# Altium schematic sheet 04. BUZZER.SchDoc
size A4; CheckedBy: 黄钦宁; Author: 陈坤; DocumentNumber: 4; SheetNumber: 4; SheetTotal: 13; PageSetup: Record=PageOptions|CenterHorizontal=True|CenterVertical=True|PrintScale=1.00|XCorrection=1.00|YCorrection=1.00|PrintKind=0|BorderSize=5000000|LeftOffset=0|BottomOffset=0|Orientation=2|PaperLength=1000|PaperWidth=1000|Scale=100|PaperSource=7|PrintQuality=600|MediaType=1|DitherType=10|PaperKind=A4|PrintScaleMode=1; DesignDate: 2013-08-16; CheckDate: 2013-12-28; SheetName: 3.3V NPN控制有源蜂鸣器; SheetVersion: V1.00; SheetDescription: 有源蜂鸣器,3.3V,高电平驱动,>2.0V鸣叫最大声,<1.2V彻底停止; ProductName: EasyARM-iMX28学习套件; ProductModel: EasyARM-iMX283
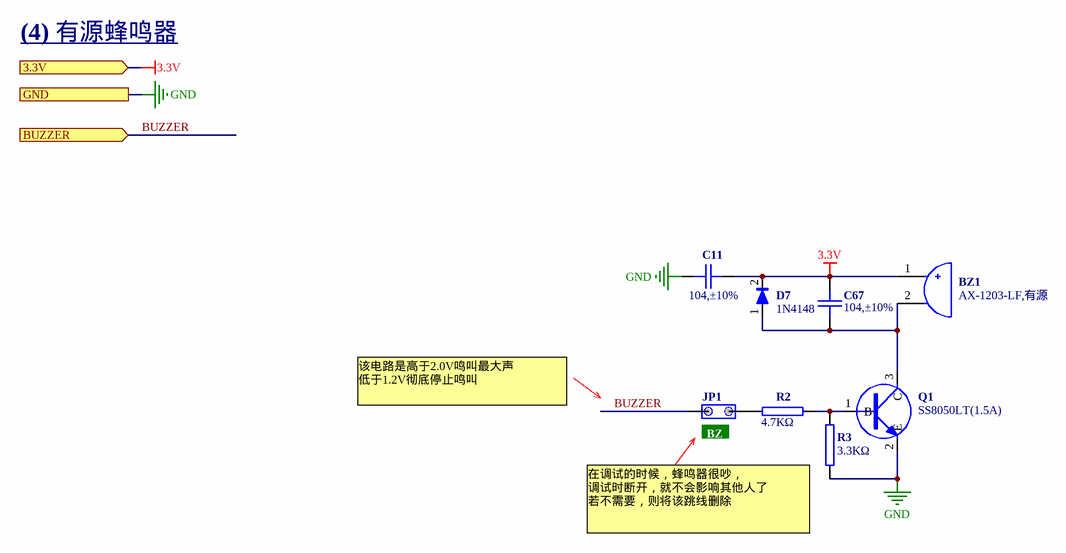
[diagram p0: 04. BUZZER.SchDoc]

## Parts
BZ1  value AX-1203-LF,有源  [BUZZ-.28/.46]  (hidden comment: BUZZER2)
C11  104,±10%  [0603C]
C67  104,±10%  [0603C]  (no BOM)
D7  value 1N4148  [SOD-323]  (hidden comment: DIODE1)  (no BOM)
JP1  120Ω_EN  [sip-2]  (value not drawn)
Q1  value SS8050LT(1.5A)  [SOT-23]  (hidden comment: NPN-1)
R2  4.7KΩ  [0603R]
R3  3.3KΩ  [0603R]

## Ports
3.3V, BUZZER (in), GND

## Nets
3.3V: BZ1.1(A) C11.1 C67.2 D7.2 ; port 3.3V
GND: C11.2 Q1.2(E) R3.1 ; port GND
BUZZER: JP1.1 ; port BUZZER
NetBZ1_2: BZ1.2(B) C67.1 D7.1 Q1.3(C)
NetJP1_2: JP1.2 R2.1
NetQ1_1: Q1.1(B) R2.2 R3.2

## Notes on the sheet
- (4) 有源蜂鸣器
- 该电路是高于2.0V鸣叫最大声
  低于1.2V彻底停止鸣叫
- (near JP1) BZ
- (near R3) 在调试的时候，蜂鸣器很吵，
  调试时断开，就不会影响其他人了
  若不需要，则将该跳线删除
- 1
- #
- 修改日期
- 修改内容
- 2
- 3
- 广州致远电子股份有限公司
- 设计人员
- 审核人员
- 设计日期
- 审核日期
- 产品名称
- 图纸名称
- 产品型号
- 图纸描述
- 图纸版本
- A4

## Library data of the parts
BZ1 = 1.06.09.0013: AX-1203-LF,有源,Φ12×7.5mm,,常州笠翔,RoHS; 名称: 讯响器; 贴片和直插: THT; 器件优选方案: 优先选用; 物料代码: 1.06.09.0013; 厂商: 常州笠翔; RoHS: RoHS; 型号: AX-1203-LF,有源,Φ12×7.5mm; ComponentLink1Description: ErpDataInfo; ComponentLink1URL: http://erp.zlgmcu.com/ErpExt/ErpData/ListMateriel.aspx?pkey=1.06.09.0013
C11 C67 = 1.02.01.0032: 104,±10%,50V,X7R,0603,*,RoHS; 名称: 电容; 封装: 0603; 设备封装名称: C0603_104_X7R_50V_10%; 贴片和直插: SMT; 物料代码: 1.02.01.0032; Value: 104,±10%; RoHS: RoHS; 型号: 104,±10%,50V,X7R; ComponentLink1Description: ErpDataInfo; ComponentLink1URL: http://erp.zlgmcu.com/ErpExt/ErpData/ListMateriel.aspx?pkey=1.02.01.0032
D7 = 1.04.07.0027: 1N4148,SOD-323,RoHS; 名称: 二极管; 设备封装名称: SOD-323_1N4148; 贴片和直插: SMT; 物料代码: 1.04.07.0027; 封装: SOD-323; RoHS: RoHS; 型号: 1N4148; ComponentLink1Description: ErpDataInfo; ComponentLink1URL: http://erp.zlgmcu.com/ErpExt/ErpData/ListMateriel.aspx?pkey=1.04.07.0027
JP1 = JMP2
Q1 = 1.04.09.0001: SS8050LT(1.5A),SOT-23,江苏长电,RoHS; 名称: 三极管; 设备封装名称: SOT-23_SS8050LT; 贴片和直插: SMT; 物料代码: 1.04.09.0001; 封装: SOT-23; 厂商: 江苏长电; RoHS: RoHS; 型号: SS8050LT(1.5A); ComponentLink1Description: ErpDataInfo; ComponentLink1URL: http://erp.zlgmcu.com/ErpExt/ErpData/ListMateriel.aspx?pkey=1.04.09.0001
R2 = 1.01.01.0045: 4.7KΩ,0603,*,RoHS; 名称: 电阻; 封装: 0603; 设备封装名称: R0603_4.7K; 贴片和直插: SMT; 物料代码: 1.01.01.0045; Value: 4.7KΩ; RoHS: RoHS; 型号: 4.7KΩ; ComponentLink1Description: ErpDataInfo; ComponentLink1URL: http://erp.zlgmcu.com/ErpExt/ErpData/ListMateriel.aspx?pkey=1.01.01.0045
R3 = 1.01.01.0043: 3.3KΩ,0603,*,RoHS; 名称: 电阻; 封装: 0603; 设备封装名称: R0603_3.3K; 贴片和直插: SMT; 物料代码: 1.01.01.0043; Value: 3.3KΩ; RoHS: RoHS; 型号: 3.3KΩ; ComponentLink1Description: ErpDataInfo; ComponentLink1URL: http://erp.zlgmcu.com/ErpExt/ErpData/ListMateriel.aspx?pkey=1.01.01.0043